# Altium schematic sheet Falcon.SchDoc
size A4
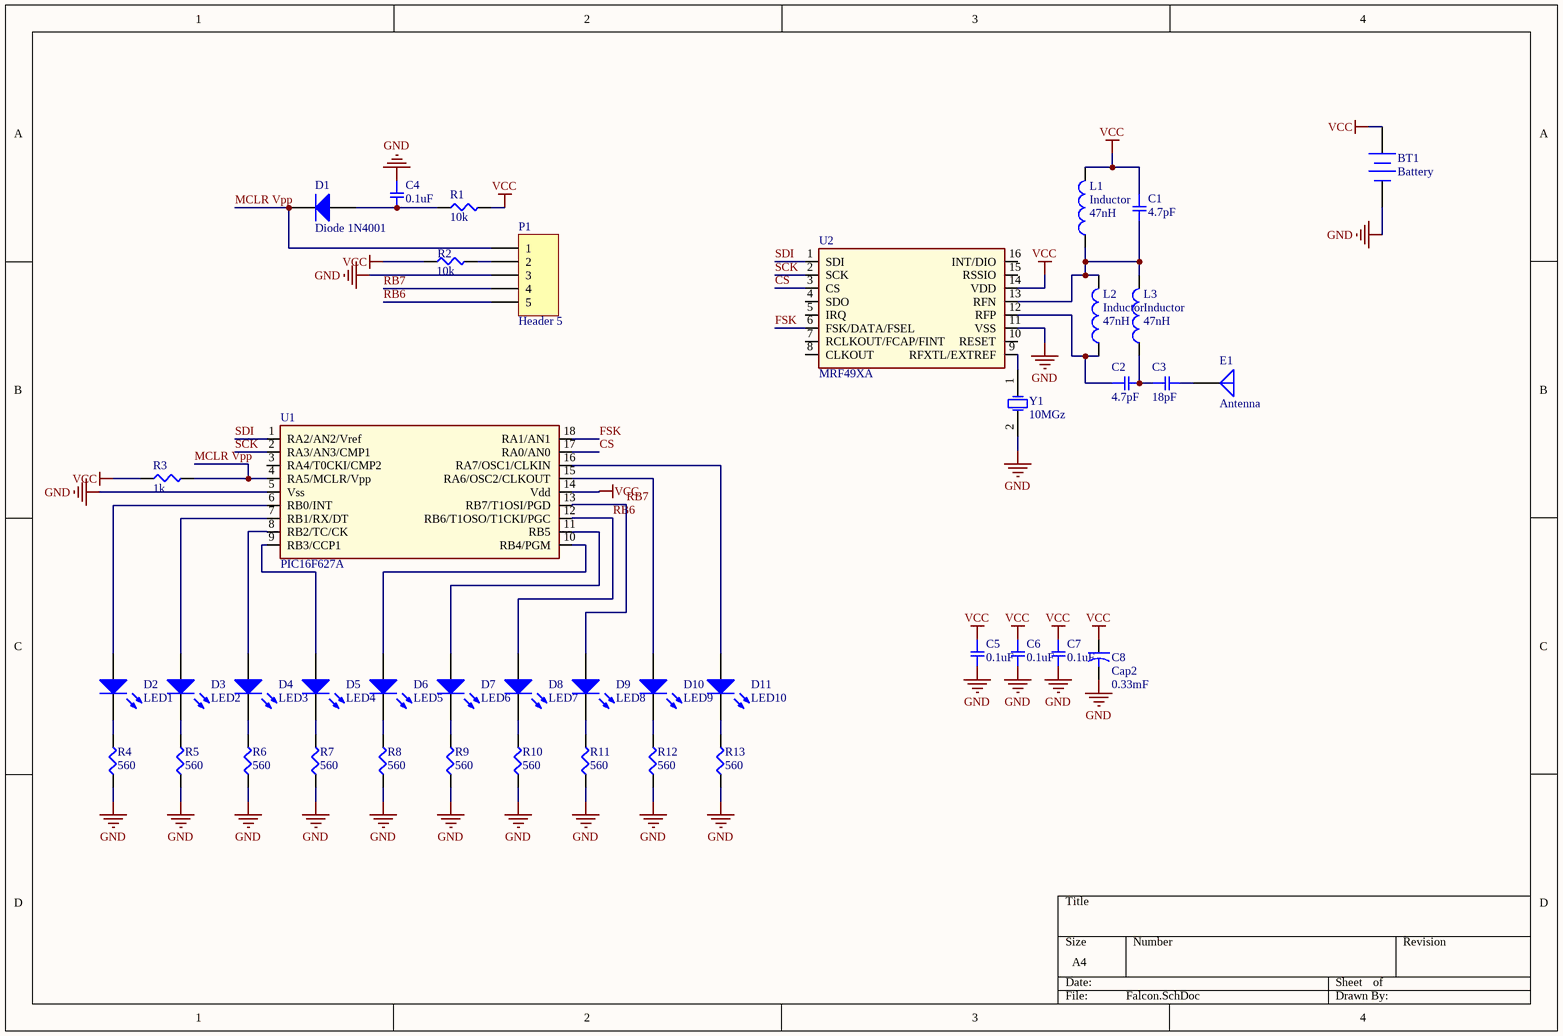
[diagram p0: Falcon.SchDoc]

## Parts
BT1  Battery  [BAT-2]
C1  4.7pF  [SMD-1206C]
C2  4.7pF  [SMD-1206C]
C3  18pF  [SMD-1206C]
C4  0.1uF  [SMD-0805C]
C5  0.1uF  [SMD-0805C]
C6  0.1uF  [SMD-0805C]
C7  0.1uF  [SMD-0805C]
C8  Cap2  value 0.33mF  [CAPR5-4X5]
D1  Diode 1N4001  [DO-41]
D2  LED1  [3.5X2.8X1.9]
D3  LED2  [3.5X2.8X1.9]
D4  LED3  [3.5X2.8X1.9]
D5  LED4  [3.5X2.8X1.9]
D6  LED5  [3.5X2.8X1.9]
D7  LED6  [3.5X2.8X1.9]
D8  LED7  [3.5X2.8X1.9]
D9  LED8  [3.5X2.8X1.9]
D10  LED9  [3.5X2.8X1.9]
D11  LED10  [3.5X2.8X1.9]
E1  Antenna  [PIN1]
L1  Inductor  value 47nH  [0402-A]
L2  Inductor  value 47nH  [0402-A]
L3  Inductor  value 47nH  [0402-A]
P1  Header 5  [HDR1X5]
R1  10k  [SMD-0805-RES]
R2  10k  [SMD-0805-RES]
R3  1k  [SMD-0805-RES]
R4  560  [SMD-0805-RES]
R5  560  [SMD-0805-RES]
R6  560  [SMD-0805-RES]
R7  560  [SMD-0805-RES]
R8  560  [SMD-0805-RES]
R9  560  [SMD-0805-RES]
R10  560  [SMD-0805-RES]
R11  560  [SMD-0805-RES]
R12  560  [SMD-0805-RES]
R13  560  [SMD-0805-RES]
U1  PIC16F627A  [PIC16F627A]
U2  MRF49XA  [MRF49XA]
Y1  10MGz  [R38]

## Nets
GND: BT1.2(-) C4.1 C5.2 C6.2 C7.2 C8.2 P1.3 R4.1 R5.1 R6.1 R7.1 R8.1 R9.1 R10.1 R11.1 R12.1 R13.1 U1.5(Vss) U2.11(VSS) Y1.2(OSC2)
VCC: BT1.1(+) C1.1 C5.1 C6.1 C7.1 C8.1 L1.2 R1.2 R2.1 R3.1 U1.14(Vdd) U2.14(VDD)
CS: U1.17(RA0/AN0) U2.3(CS)
FSK: U1.18(RA1/AN1) U2.6(FSK/DATA/FSEL)
MCLR Vpp: D1.2(K) P1.1 R3.2 U1.4(RA5/MCLR/Vpp)
RB6: D8.1(A) P1.5 U1.12(RB6/T1OSO/T1CKI/PGC)
RB7: D9.1(A) P1.4 U1.13(RB7/T1OSI/PGD)
SCK: U1.2(RA3/AN3/CMP1) U2.2(SCK)
SDI: U1.1(RA2/AN2/Vref) U2.1(SDI)
NetC1_2: C1.2 L1.1 L2.2 L3.2 U2.13(RFN)
NetC2_1: C2.1 L2.1 U2.12(RFP)
NetC2_2: C2.2 C3.1 L3.1
NetC3_2: C3.2 E1.1(A)
NetC4_2: C4.2 D1.1(A) R1.1
NetD2_1: D2.1(A) U1.6(RB0/INT)
NetD2_2: D2.2(K) R4.2
NetD3_1: D3.1(A) U1.7(RB1/RX/DT)
NetD3_2: D3.2(K) R5.2
NetD4_1: D4.1(A) U1.8(RB2/TC/CK)
NetD4_2: D4.2(K) R6.2
NetD5_1: D5.1(A) U1.9(RB3/CCP1)
NetD5_2: D5.2(K) R7.2
NetD6_1: D6.1(A) U1.10(RB4/PGM)
NetD6_2: D6.2(K) R8.2
NetD7_1: D7.1(A) U1.11(RB5)
NetD7_2: D7.2(K) R9.2
NetD8_2: D8.2(K) R10.2
NetD9_2: D9.2(K) R11.2
NetD10_1: D10.1(A) U1.15(RA6/OSC2/CLKOUT)
NetD10_2: D10.2(K) R12.2
NetD11_1: D11.1(A) U1.16(RA7/OSC1/CLKIN)
NetD11_2: D11.2(K) R13.2
NetP1_2: P1.2 R2.2
NetU2_9: U2.9(RFXTL/EXTREF) Y1.1(OSC1)

Not connected (* = marked no-connect by the designer): U1 3(RA4/T0CKI/CMP2); U2 4(SDO) 5(IRQ) 7(RCLKOUT/FCAP/FINT) 8(CLKOUT) 10(RESET) 15(RSSIO) 16(INT/DIO)

## Library data of the parts
BT1 = Battery: Multicell Battery; Published: 24-Mar-1999; LatestRevisionDate: 17-Jul-2002; LatestRevisionNote: Re-released for DXP Platform.; PackageReference: BAT-2; Publisher: Altium Limited; PackageDescription: Battery; 2 Leads
C1-C3 = GC331AD72E333KX01D: CAP CER 0.033UF 250V X7T 1206; Manufacturer: Murata Electronics North America; Factory Stock: 0; Unit Price (USD): 0.33; Minimum Quantity: 1; Value: 0.033µF; Tolerance: ±10%; Datasheets: http://search.murata.co.jp/Ceramy/image/img/A01X/G101/ENG/GC331AD72E333KX01-01.pdf; Image: //media.digikey.com/Renders/Murata%20Renders/1206(GC3)320x160.jpg; Digi-Key Part Number: 490-13989-1-ND; Part Number: GC331AD72E333KX01D; Quantity Available: 3999; @ qty: 0; Packaging: Cut Tape (CT); Series: GC3; Part Status: Active; Voltage: 250V; Temperature Coefficient: X7T; Operating Temperature: -55°C ~ 125°C; Features: -; Ratings: AEC-Q200; Applications: Automotive; Mounting Type: Surface Mount, MLCC; Package / Case: 1206 (3216 Metric); Size / Dimension: 0.126" L x 0.063" W (3.20mm x 1.60mm); Height - Seated (Max): -; Thickness (Max): 0.039" (1.00mm); Lead Spacing: -; Lead Style: -
C4-C7 = GC321AD72E103KX01D: CAP CER 10000PF 250V X7T 0805; Manufacturer: Murata Electronics North America; Factory Stock: 0; Unit Price (USD): 0.3; Minimum Quantity: 1; Tolerance: ±10%; Datasheets: http://search.murata.co.jp/Ceramy/image/img/A01X/G101/ENG/GC321AD72E103KX01-01.pdf; Image: //media.digikey.com/Renders/Murata%20Renders/0805(GC3)200x125.jpg; Digi-Key Part Number: 490-13986-1-ND; Part Number: GC321AD72E103KX01D; Quantity Available: 4000; @ qty: 0; Packaging: Cut Tape (CT); Series: GC3; Part Status: Active; Value: 10000pF; Voltage: 250V; Temperature Coefficient: X7T; Operating Temperature: -55°C ~ 125°C; Features: -; Ratings: AEC-Q200; Applications: Automotive; Mounting Type: Surface Mount, MLCC; Package / Case: 0805 (2012 Metric); Size / Dimension: 0.079" L x 0.049" W (2.00mm x 1.25mm); Height - Seated (Max): -; Thickness (Max): 0.039" (1.00mm); Lead Spacing: -; Lead Style: -
C8 = Cap2: Capacitor; Published: 23-Sep-2002; PackageReference: CAPR5-4X5; Publisher: Altium Limited; PackageDescription: Capacitor; 2 Leads
D1 = Diode 1N4001: 1 Amp General Purpose Rectifier; Published: 8-Jun-2000; LatestRevisionDate: 17-Jul-2002; LatestRevisionNote: Re-released for DXP Platform.; DatasheetVersion: 1998; PackageVersion: Aug-1999; PackageReference: DO-41; Publisher: Altium Limited; PackageDescription: Diode, Axial; Body 5.2 x 2.7 mm (LxDia. max), Lead Dia. 0.86 mm (max); Code_JEDEC: DO-204-AL; ComponentLink1Description: Manufacturer Link; ComponentLink1URL: http://www.fairchildsemi.com/; ComponentLink2Description: Datasheet; ComponentLink2URL: http://www.fairchildsemi.com/ds/1N%2F1N4001.pdf
D2-D11 = LED3: Typical BLUE SiC LED; Published: 8-Jun-2000; LatestRevisionDate: 17-Dec-2003; LatestRevisionNote: PCB Footprint replaced.; DatasheetVersion: 16-Apr-2002; PackageVersion: 16-Apr-2002; PackageReference: 3.5X2.8X1.9; Publisher: Altium Limited; PackageDescription: SM LED; 2 C-Bend Leads; Body 3.5 x 2.8 x 1.9 mm, inc leads (LxWxH typ)
E1 = Antenna: Generic Antenna; Published: 24-Mar-1999; LatestRevisionDate: 17-Jul-2002; LatestRevisionNote: Re-released for DXP Platform.; PackageReference: PIN1; Publisher: Altium Limited
L1-L3 = Inductor: Code_IEC: 1005; Published: 8-Jun-2000; LatestRevisionDate: 29-May-2009; LatestRevisionNote: IPC-7351 Footprint Added.; PackageReference: 0402-A; Publisher: Altium Limited; PackageDescription: Chip Inductor; Code_JEITA: 0402
P1 = Header 5: Header, 5-Pin; LatestRevisionDate: 17-Jul-2002; LatestRevisionNote: Re-released for DXP Platform.; Publisher: Altium Limited
R1-R13 = ERJ-6BQF1R0V: RES SMD 1 OHM 1% 1/3W 0805; Manufacturer: Panasonic Electronic Components; Factory Stock: 0; Unit Price (USD): 0.05834; @ qty: 1500; Minimum Quantity: 1; Value: 1; Power (Watts): 0.333W, 1/3W; Temperature Coefficient: ±200ppm/°C; Part Number: ERJ-6BQF1R0V; Datasheets: https://industrial.panasonic.com/cdbs/www-data/pdf/RDA0000/AOA0000C239.pdf; Image: //media.digikey.com/Renders/Panasonic%20Renders/ERJ-0805%20Pkg.jpg; Digi-Key Part Number: P17499CT-ND; Quantity Available: 808; Packaging: Cut Tape (CT); Series: ERJ; Part Status: Active; Tolerance: ±1%; Composition: Thick Film; Features: Automotive AEC-Q200, Current Sense; Operating Temperature: -55°C ~ 125°C; Package / Case: 0805 (2012 Metric); Supplier Device Package: 0805; Size / Dimension: 0.079" L x 0.049" W (2.00mm x 1.25mm); Height - Seated (Max): 0.028" (0.70mm); Number of Terminations: 2; Failure Rate: -
Y1 = XTAL: Crystal Oscillator; Published: 8-Jun-2000; LatestRevisionDate: 17-Jul-2002; LatestRevisionNote: Re-released for DXP Platform.; PackageReference: R38; Publisher: Altium Limited; PackageDescription: Crystal, Thru-Hole; 2 Leads; Body 3.1 x 8.2 mm (Dia.xH)